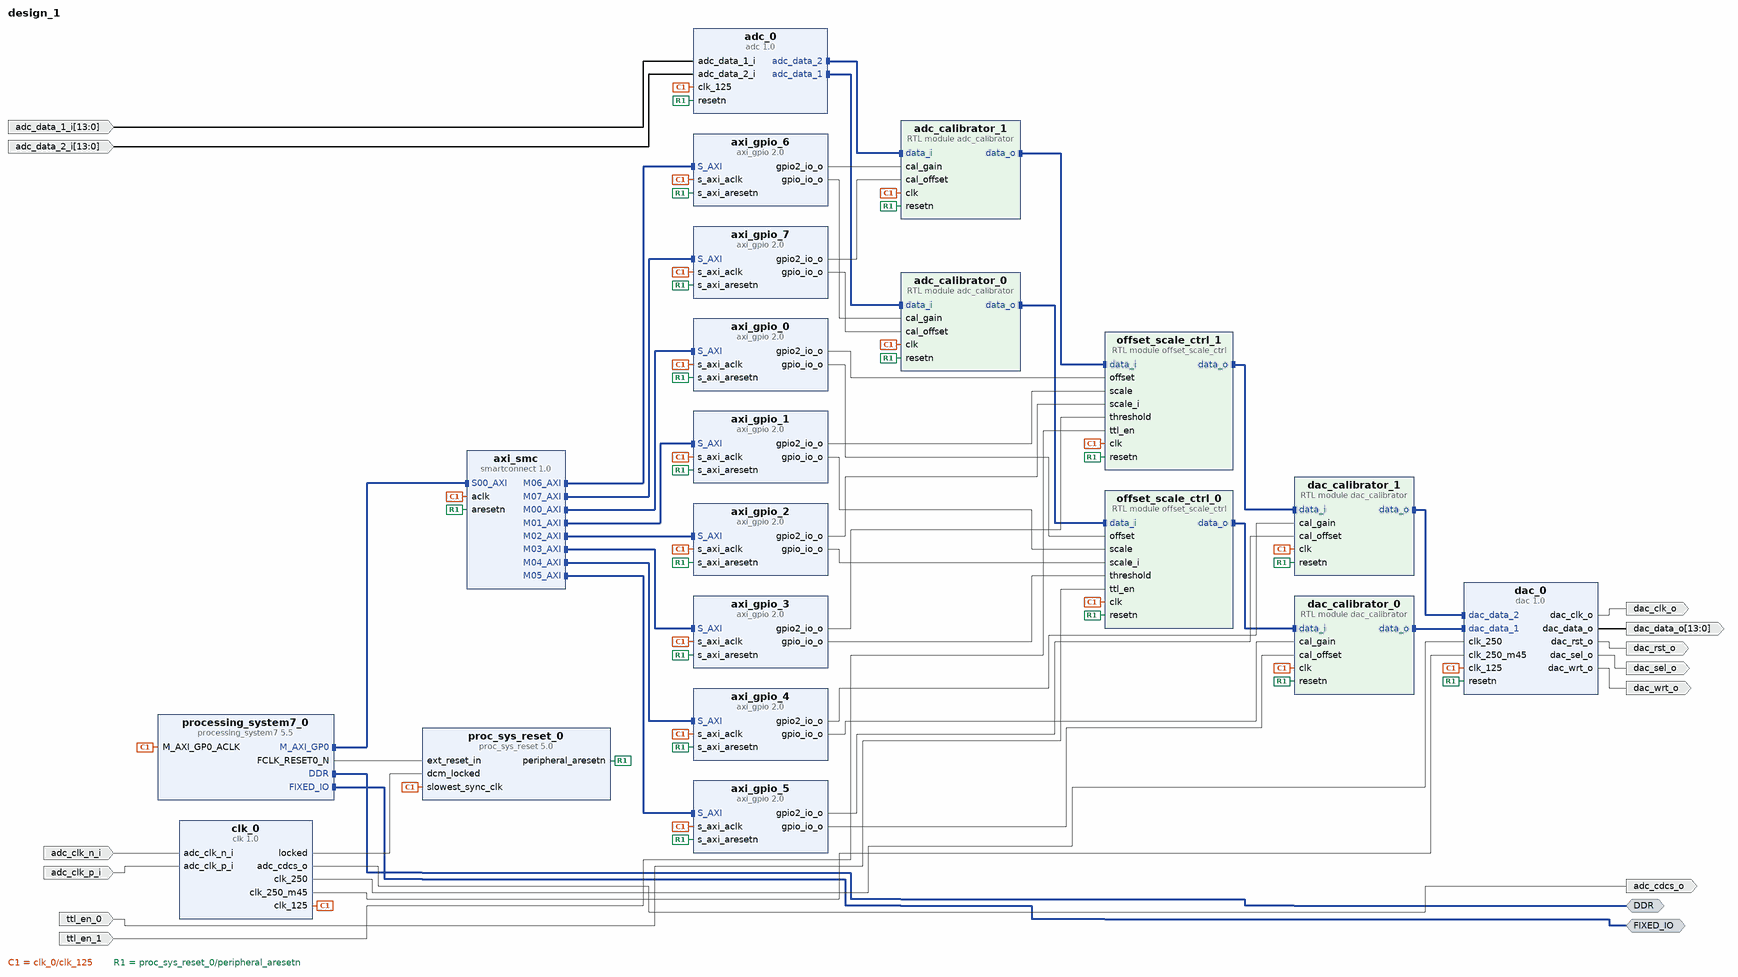
[diagram p0: block diagram of the top level]
# Vivado block design design_1, xc7z010clg400-1, Vivado 2025.2
create_bd_design design_1

create_bd_intf_port -mode Master -vlnv xilinx.com:interface:ddrx_rtl:1.0 DDR
create_bd_intf_port -mode Master -vlnv xilinx.com:display_processing_system7:fixedio_rtl:1.0 FIXED_IO
create_bd_port -dir I adc_clk_n_i
create_bd_port -dir I adc_clk_p_i
create_bd_port -dir O adc_cdcs_o
create_bd_port -dir O dac_clk_o
create_bd_port -dir O -from 13 -to 0 dac_data_o
create_bd_port -dir O dac_rst_o
create_bd_port -dir O dac_sel_o
create_bd_port -dir O dac_wrt_o
create_bd_port -dir I -from 13 -to 0 adc_data_1_i
create_bd_port -dir I -from 13 -to 0 adc_data_2_i
create_bd_port -dir I ttl_en_0
create_bd_port -dir I ttl_en_1

create_bd_cell -type ip -vlnv xilinx.com:ip:processing_system7:5.5 processing_system7_0
set_property -dict [list \
  CONFIG.PCW_ENET0_ENET0_IO {MIO 16 .. 27} \
  CONFIG.PCW_ENET0_GRP_MDIO_ENABLE 1 \
  CONFIG.PCW_ENET0_GRP_MDIO_IO {MIO 52 .. 53} \
  CONFIG.PCW_ENET0_PERIPHERAL_ENABLE 1 \
  CONFIG.PCW_ENET0_RESET_ENABLE 0 \
  CONFIG.PCW_ENET_RESET_ENABLE 1 \
  CONFIG.PCW_ENET_RESET_SELECT {Share reset pin} \
  CONFIG.PCW_FPGA0_PERIPHERAL_FREQMHZ 50 \
  CONFIG.PCW_FPGA1_PERIPHERAL_FREQMHZ 50 \
  CONFIG.PCW_GPIO_MIO_GPIO_ENABLE 1 \
  CONFIG.PCW_GPIO_MIO_GPIO_IO MIO \
  CONFIG.PCW_I2C_RESET_ENABLE 1 \
  CONFIG.PCW_PERIPHERAL_BOARD_PRESET part0 \
  CONFIG.PCW_PRESET_BANK1_VOLTAGE {LVCMOS 2.5V} \
  CONFIG.PCW_QSPI_PERIPHERAL_ENABLE 0 \
  CONFIG.PCW_SD0_GRP_CD_ENABLE 1 \
  CONFIG.PCW_SD0_GRP_CD_IO {MIO 46} \
  CONFIG.PCW_SD0_GRP_WP_ENABLE 1 \
  CONFIG.PCW_SD0_GRP_WP_IO {MIO 47} \
  CONFIG.PCW_SD0_PERIPHERAL_ENABLE 1 \
  CONFIG.PCW_SD0_SD0_IO {MIO 40 .. 45} \
  CONFIG.PCW_SDIO_PERIPHERAL_FREQMHZ 100 \
  CONFIG.PCW_UART0_PERIPHERAL_ENABLE 1 \
  CONFIG.PCW_UART0_UART0_IO {MIO 14 .. 15} \
  CONFIG.PCW_UART1_PERIPHERAL_ENABLE 0 \
  CONFIG.PCW_UART_PERIPHERAL_FREQMHZ 100 \
  CONFIG.PCW_UIPARAM_DDR_BUS_WIDTH {16 Bit} \
  CONFIG.PCW_UIPARAM_DDR_PARTNO {MT41J256M16 RE-125} \
  CONFIG.PCW_USB0_PERIPHERAL_ENABLE 1 \
  CONFIG.PCW_USB0_RESET_ENABLE 1 \
  CONFIG.PCW_USB0_RESET_IO {MIO 48} \
  CONFIG.PCW_USB0_USB0_IO {MIO 28 .. 39} \
  CONFIG.PCW_USB_RESET_ENABLE 1 \
  CONFIG.PCW_USB_RESET_SELECT {Share reset pin} \
] [get_bd_cells processing_system7_0]
# 230 more settings of processing_system7_0 are not shown: defaults, MIO pin electricals, DDR timing, and values the tool derives
create_bd_cell -type ip -vlnv xilinx.com:ip:proc_sys_reset:5.0 proc_sys_reset_0
create_bd_cell -type ip -vlnv xilinx.com:ip:axi_gpio:2.0 axi_gpio_0
set_property -dict [list \
  CONFIG.C_ALL_OUTPUTS 1 \
  CONFIG.C_ALL_OUTPUTS_2 1 \
  CONFIG.C_GPIO2_WIDTH 16 \
  CONFIG.C_GPIO_WIDTH 16 \
  CONFIG.C_IS_DUAL 1 \
] [get_bd_cells axi_gpio_0]
create_bd_cell -type ip -vlnv DSPsandbox:FPGA-Notes-for-Scientists:clk:1.0 clk_0
create_bd_cell -type ip -vlnv DSPsandbox:FPGA-Notes-for-Scientists:adc:1.0 adc_0
create_bd_cell -type ip -vlnv DSPsandbox:FPGA-Notes-for-Scientist:dac:1.0 dac_0
create_bd_cell -type ip -vlnv xilinx.com:ip:smartconnect:1.0 axi_smc
set_property -dict {CONFIG.NUM_MI 8 CONFIG.NUM_SI 1} [get_bd_cells axi_smc]
create_bd_cell -type module -reference offset_scale_ctrl offset_scale_ctrl_0
create_bd_cell -type module -reference offset_scale_ctrl offset_scale_ctrl_1
create_bd_cell -type ip -vlnv xilinx.com:ip:axi_gpio:2.0 axi_gpio_1
set_property -dict [list \
  CONFIG.C_ALL_OUTPUTS 1 \
  CONFIG.C_ALL_OUTPUTS_2 1 \
  CONFIG.C_GPIO2_WIDTH 16 \
  CONFIG.C_GPIO_WIDTH 16 \
  CONFIG.C_INTERRUPT_PRESENT 0 \
  CONFIG.C_IS_DUAL 1 \
] [get_bd_cells axi_gpio_1]
create_bd_cell -type ip -vlnv xilinx.com:ip:axi_gpio:2.0 axi_gpio_2
set_property -dict [list \
  CONFIG.C_ALL_OUTPUTS 1 \
  CONFIG.C_ALL_OUTPUTS_2 1 \
  CONFIG.C_GPIO2_WIDTH 16 \
  CONFIG.C_GPIO_WIDTH 16 \
  CONFIG.C_IS_DUAL 1 \
] [get_bd_cells axi_gpio_2]
create_bd_cell -type ip -vlnv xilinx.com:ip:axi_gpio:2.0 axi_gpio_3
set_property -dict [list \
  CONFIG.C_ALL_OUTPUTS 1 \
  CONFIG.C_ALL_OUTPUTS_2 1 \
  CONFIG.C_GPIO2_WIDTH 16 \
  CONFIG.C_GPIO_WIDTH 16 \
  CONFIG.C_IS_DUAL 1 \
] [get_bd_cells axi_gpio_3]
create_bd_cell -type ip -vlnv xilinx.com:ip:axi_gpio:2.0 axi_gpio_4
set_property -dict [list \
  CONFIG.C_ALL_OUTPUTS 1 \
  CONFIG.C_ALL_OUTPUTS_2 1 \
  CONFIG.C_GPIO2_WIDTH 16 \
  CONFIG.C_GPIO_WIDTH 16 \
  CONFIG.C_INTERRUPT_PRESENT 0 \
  CONFIG.C_IS_DUAL 1 \
] [get_bd_cells axi_gpio_4]
create_bd_cell -type ip -vlnv xilinx.com:ip:axi_gpio:2.0 axi_gpio_5
set_property -dict [list \
  CONFIG.C_ALL_OUTPUTS 1 \
  CONFIG.C_ALL_OUTPUTS_2 1 \
  CONFIG.C_GPIO2_WIDTH 16 \
  CONFIG.C_GPIO_WIDTH 16 \
  CONFIG.C_INTERRUPT_PRESENT 0 \
  CONFIG.C_IS_DUAL 1 \
] [get_bd_cells axi_gpio_5]
create_bd_cell -type module -reference dac_calibrator dac_calibrator_0
create_bd_cell -type module -reference dac_calibrator dac_calibrator_1
create_bd_cell -type ip -vlnv xilinx.com:ip:axi_gpio:2.0 axi_gpio_6
set_property -dict [list \
  CONFIG.C_ALL_OUTPUTS 1 \
  CONFIG.C_ALL_OUTPUTS_2 1 \
  CONFIG.C_GPIO2_WIDTH 16 \
  CONFIG.C_GPIO_WIDTH 16 \
  CONFIG.C_INTERRUPT_PRESENT 0 \
  CONFIG.C_IS_DUAL 1 \
] [get_bd_cells axi_gpio_6]
create_bd_cell -type ip -vlnv xilinx.com:ip:axi_gpio:2.0 axi_gpio_7
set_property -dict [list \
  CONFIG.C_ALL_OUTPUTS 1 \
  CONFIG.C_ALL_OUTPUTS_2 1 \
  CONFIG.C_GPIO2_WIDTH 16 \
  CONFIG.C_GPIO_WIDTH 16 \
  CONFIG.C_INTERRUPT_PRESENT 0 \
  CONFIG.C_IS_DUAL 1 \
] [get_bd_cells axi_gpio_7]
create_bd_cell -type module -reference adc_calibrator adc_calibrator_0
create_bd_cell -type module -reference adc_calibrator adc_calibrator_1

# ---- connections ----

connect_bd_intf_net [get_bd_intf_pins adc_0/adc_data_1] [get_bd_intf_pins adc_calibrator_0/data_i]
connect_bd_intf_net [get_bd_intf_pins adc_0/adc_data_2] [get_bd_intf_pins adc_calibrator_1/data_i]
connect_bd_intf_net [get_bd_intf_pins adc_calibrator_0/data_o] [get_bd_intf_pins offset_scale_ctrl_0/data_i]
connect_bd_intf_net [get_bd_intf_pins adc_calibrator_1/data_o] [get_bd_intf_pins offset_scale_ctrl_1/data_i]
connect_bd_intf_net [get_bd_intf_pins axi_smc/M00_AXI] [get_bd_intf_pins axi_gpio_0/S_AXI]
connect_bd_intf_net [get_bd_intf_pins axi_smc/M01_AXI] [get_bd_intf_pins axi_gpio_1/S_AXI]
connect_bd_intf_net [get_bd_intf_pins axi_smc/M02_AXI] [get_bd_intf_pins axi_gpio_2/S_AXI]
connect_bd_intf_net [get_bd_intf_pins axi_smc/M03_AXI] [get_bd_intf_pins axi_gpio_3/S_AXI]
connect_bd_intf_net [get_bd_intf_pins axi_smc/M04_AXI] [get_bd_intf_pins axi_gpio_4/S_AXI]
connect_bd_intf_net [get_bd_intf_pins axi_smc/M05_AXI] [get_bd_intf_pins axi_gpio_5/S_AXI]
connect_bd_intf_net [get_bd_intf_pins axi_smc/M06_AXI] [get_bd_intf_pins axi_gpio_6/S_AXI]
connect_bd_intf_net [get_bd_intf_pins axi_smc/M07_AXI] [get_bd_intf_pins axi_gpio_7/S_AXI]
connect_bd_intf_net [get_bd_intf_pins dac_calibrator_0/data_o] [get_bd_intf_pins dac_0/dac_data_1]
connect_bd_intf_net [get_bd_intf_pins dac_calibrator_1/data_o] [get_bd_intf_pins dac_0/dac_data_2]
connect_bd_intf_net [get_bd_intf_pins offset_scale_ctrl_0/data_o] [get_bd_intf_pins dac_calibrator_0/data_i]
connect_bd_intf_net [get_bd_intf_pins offset_scale_ctrl_1/data_o] [get_bd_intf_pins dac_calibrator_1/data_i]
connect_bd_intf_net [get_bd_intf_ports DDR] [get_bd_intf_pins processing_system7_0/DDR]
connect_bd_intf_net [get_bd_intf_ports FIXED_IO] [get_bd_intf_pins processing_system7_0/FIXED_IO]
connect_bd_intf_net [get_bd_intf_pins processing_system7_0/M_AXI_GP0] [get_bd_intf_pins axi_smc/S00_AXI]
connect_bd_net [get_bd_ports adc_clk_n_i] [get_bd_pins clk_0/adc_clk_n_i]
connect_bd_net [get_bd_ports adc_clk_p_i] [get_bd_pins clk_0/adc_clk_p_i]
connect_bd_net [get_bd_ports adc_data_1_i] [get_bd_pins adc_0/adc_data_1_i]
connect_bd_net [get_bd_ports adc_data_2_i] [get_bd_pins adc_0/adc_data_2_i]
connect_bd_net [get_bd_pins axi_gpio_0/gpio2_io_o] [get_bd_pins offset_scale_ctrl_1/offset]
connect_bd_net [get_bd_pins axi_gpio_0/gpio_io_o] [get_bd_pins offset_scale_ctrl_0/offset]
connect_bd_net [get_bd_pins axi_gpio_1/gpio2_io_o] [get_bd_pins offset_scale_ctrl_1/scale]
connect_bd_net [get_bd_pins axi_gpio_1/gpio_io_o] [get_bd_pins offset_scale_ctrl_0/scale]
connect_bd_net [get_bd_pins axi_gpio_2/gpio2_io_o] [get_bd_pins offset_scale_ctrl_1/scale_i]
connect_bd_net [get_bd_pins axi_gpio_2/gpio_io_o] [get_bd_pins offset_scale_ctrl_0/scale_i]
connect_bd_net [get_bd_pins axi_gpio_3/gpio2_io_o] [get_bd_pins offset_scale_ctrl_1/threshold]
connect_bd_net [get_bd_pins axi_gpio_3/gpio_io_o] [get_bd_pins offset_scale_ctrl_0/threshold]
connect_bd_net [get_bd_pins axi_gpio_4/gpio2_io_o] [get_bd_pins dac_calibrator_1/cal_gain]
connect_bd_net [get_bd_pins axi_gpio_4/gpio_io_o] [get_bd_pins dac_calibrator_0/cal_gain]
connect_bd_net [get_bd_pins axi_gpio_5/gpio2_io_o] [get_bd_pins dac_calibrator_1/cal_offset]
connect_bd_net [get_bd_pins axi_gpio_5/gpio_io_o] [get_bd_pins dac_calibrator_0/cal_offset]
connect_bd_net [get_bd_pins axi_gpio_6/gpio2_io_o] [get_bd_pins adc_calibrator_1/cal_gain]
connect_bd_net [get_bd_pins axi_gpio_6/gpio_io_o] [get_bd_pins adc_calibrator_0/cal_gain]
connect_bd_net [get_bd_pins axi_gpio_7/gpio2_io_o] [get_bd_pins adc_calibrator_1/cal_offset]
connect_bd_net [get_bd_pins axi_gpio_7/gpio_io_o] [get_bd_pins adc_calibrator_0/cal_offset]
connect_bd_net [get_bd_pins clk_0/adc_cdcs_o] [get_bd_ports adc_cdcs_o]
connect_bd_net [get_bd_pins clk_0/clk_125] \
  [get_bd_pins dac_0/clk_125] [get_bd_pins adc_0/clk_125] [get_bd_pins axi_smc/aclk] [get_bd_pins offset_scale_ctrl_0/clk] \
  [get_bd_pins offset_scale_ctrl_1/clk] [get_bd_pins axi_gpio_0/s_axi_aclk] [get_bd_pins axi_gpio_1/s_axi_aclk] \
  [get_bd_pins axi_gpio_2/s_axi_aclk] [get_bd_pins axi_gpio_3/s_axi_aclk] [get_bd_pins proc_sys_reset_0/slowest_sync_clk] \
  [get_bd_pins processing_system7_0/M_AXI_GP0_ACLK] [get_bd_pins axi_gpio_4/s_axi_aclk] [get_bd_pins axi_gpio_5/s_axi_aclk] \
  [get_bd_pins dac_calibrator_0/clk] [get_bd_pins dac_calibrator_1/clk] [get_bd_pins axi_gpio_6/s_axi_aclk] \
  [get_bd_pins axi_gpio_7/s_axi_aclk] [get_bd_pins adc_calibrator_0/clk] [get_bd_pins adc_calibrator_1/clk]
connect_bd_net [get_bd_pins clk_0/clk_250] [get_bd_pins dac_0/clk_250]
connect_bd_net [get_bd_pins clk_0/clk_250_m45] [get_bd_pins dac_0/clk_250_m45]
connect_bd_net [get_bd_pins clk_0/locked] [get_bd_pins proc_sys_reset_0/dcm_locked]
connect_bd_net [get_bd_pins dac_0/dac_clk_o] [get_bd_ports dac_clk_o]
connect_bd_net [get_bd_pins dac_0/dac_data_o] [get_bd_ports dac_data_o]
connect_bd_net [get_bd_pins dac_0/dac_rst_o] [get_bd_ports dac_rst_o]
connect_bd_net [get_bd_pins dac_0/dac_sel_o] [get_bd_ports dac_sel_o]
connect_bd_net [get_bd_pins dac_0/dac_wrt_o] [get_bd_ports dac_wrt_o]
connect_bd_net [get_bd_pins proc_sys_reset_0/peripheral_aresetn] \
  [get_bd_pins adc_0/resetn] [get_bd_pins dac_0/resetn] [get_bd_pins axi_smc/aresetn] \
  [get_bd_pins offset_scale_ctrl_0/resetn] [get_bd_pins offset_scale_ctrl_1/resetn] [get_bd_pins axi_gpio_0/s_axi_aresetn] \
  [get_bd_pins axi_gpio_1/s_axi_aresetn] [get_bd_pins axi_gpio_2/s_axi_aresetn] [get_bd_pins axi_gpio_3/s_axi_aresetn] \
  [get_bd_pins axi_gpio_4/s_axi_aresetn] [get_bd_pins axi_gpio_5/s_axi_aresetn] [get_bd_pins dac_calibrator_0/resetn] \
  [get_bd_pins dac_calibrator_1/resetn] [get_bd_pins axi_gpio_6/s_axi_aresetn] [get_bd_pins axi_gpio_7/s_axi_aresetn] \
  [get_bd_pins adc_calibrator_0/resetn] [get_bd_pins adc_calibrator_1/resetn]
connect_bd_net [get_bd_pins processing_system7_0/FCLK_RESET0_N] [get_bd_pins proc_sys_reset_0/ext_reset_in]
connect_bd_net -net ttl_en_0_1 [get_bd_ports ttl_en_0] [get_bd_pins offset_scale_ctrl_0/ttl_en]
connect_bd_net -net ttl_en_1_1 [get_bd_ports ttl_en_1] [get_bd_pins offset_scale_ctrl_1/ttl_en]

# ---- address map ----
assign_bd_address -offset 0x41200000 -range 64K -target_address_space [get_bd_addr_spaces processing_system7_0/Data] [get_bd_addr_segs axi_gpio_0/S_AXI/Reg]
assign_bd_address -offset 0x41210000 -range 64K -target_address_space [get_bd_addr_spaces processing_system7_0/Data] [get_bd_addr_segs axi_gpio_1/S_AXI/Reg]
assign_bd_address -offset 0x41220000 -range 64K -target_address_space [get_bd_addr_spaces processing_system7_0/Data] [get_bd_addr_segs axi_gpio_2/S_AXI/Reg]
assign_bd_address -offset 0x41230000 -range 64K -target_address_space [get_bd_addr_spaces processing_system7_0/Data] [get_bd_addr_segs axi_gpio_3/S_AXI/Reg]
assign_bd_address -offset 0x41240000 -range 64K -target_address_space [get_bd_addr_spaces processing_system7_0/Data] [get_bd_addr_segs axi_gpio_4/S_AXI/Reg]
assign_bd_address -offset 0x41250000 -range 64K -target_address_space [get_bd_addr_spaces processing_system7_0/Data] [get_bd_addr_segs axi_gpio_5/S_AXI/Reg]
assign_bd_address -offset 0x41260000 -range 64K -target_address_space [get_bd_addr_spaces processing_system7_0/Data] [get_bd_addr_segs axi_gpio_6/S_AXI/Reg]
assign_bd_address -offset 0x41270000 -range 64K -target_address_space [get_bd_addr_spaces processing_system7_0/Data] [get_bd_addr_segs axi_gpio_7/S_AXI/Reg]

validate_bd_design
save_bd_design
